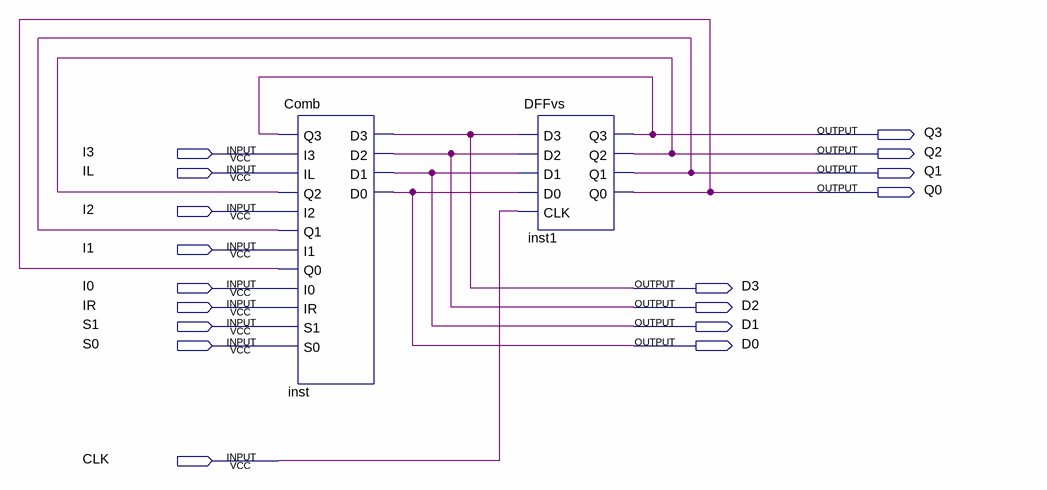
[diagram p0: schematic sheet]
// Quartus schematic 4VersatileShifter.bdf as structural Verilog: 2 symbols, 17 pins
module \4VersatileShifter  (
  input  I3,
  input  IL,
  input  I2,
  input  I1,
  input  I0,
  input  IR,
  input  S1,
  input  S0,
  input  CLK,
  output Q3,
  output Q2,
  output Q1,
  output Q0,
  output D3,
  output D2,
  output D1,
  output D0
);

  Comb inst (
    .Q3(Q3), .I3(I3), .IL(IL), .Q2(Q2), .I2(I2), .Q1(Q1), .I1(I1), .Q0(Q0), .I0(I0), .IR(IR), .S1(S1),
    .S0(S0), .D3(D3), .D2(D2), .D1(D1), .D0(D0));
  DFFvs inst1 (.D3(D3), .D2(D2), .D1(D1), .D0(D0), .CLK(CLK), .Q3(Q3), .Q2(Q2), .Q1(Q1), .Q0(Q0));
endmodule
